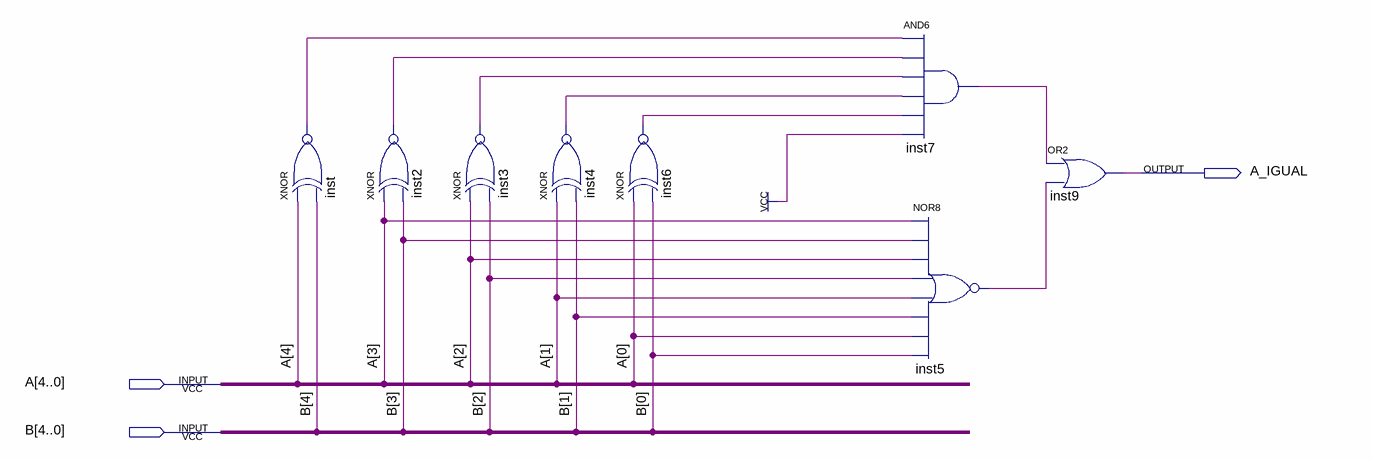
[diagram p0: schematic sheet]
// Quartus schematic CompararIgualdade.bdf as structural Verilog: 8 symbols, 3 pins
module CompararIgualdade (
  input  [4:0] A,
  input  [4:0] B,
  output A_IGUAL
);

  wire inst2_out, inst3_out, inst4_out, inst5_out, inst6_out, inst7_out, inst_out;

  xnor inst (inst_out, A[4], B[4]);
  xnor inst2 (inst2_out, A[3], B[3]);
  xnor inst3 (inst3_out, A[2], B[2]);
  xnor inst4 (inst4_out, A[1], B[1]);
  xnor inst6 (inst6_out, A[0], B[0]);
  and inst7 (inst7_out, inst_out, inst2_out, inst3_out, inst4_out, inst6_out, 1'b1);
  nor inst5 (inst5_out, A[3], B[3], A[2], B[2], A[1], B[1], A[0], B[0]);
  or inst9 (A_IGUAL, inst7_out, inst5_out);
endmodule
